# Altium schematic sheet Temperature Sensor.SchDoc
size A4; SheetNumber: 5; SheetTotal: 9
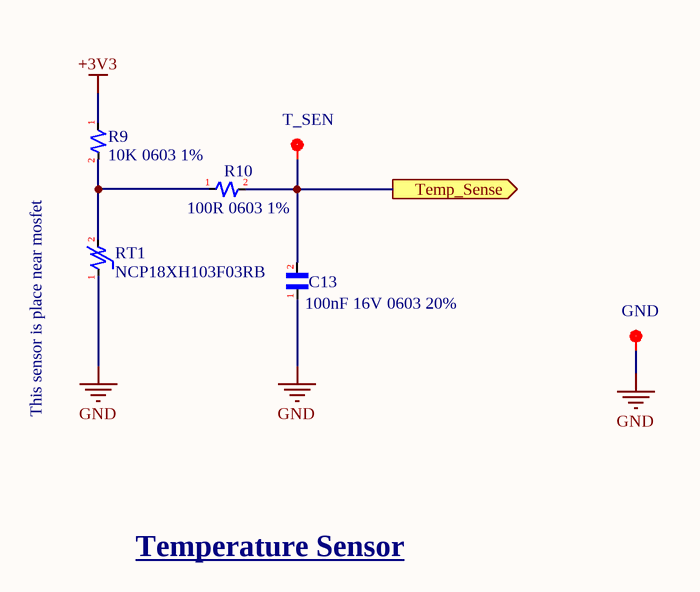
[diagram p0: Temperature Sensor.SchDoc]

## Parts
C13  100nF 16V 0603 20%  [C_0603]
R9  10K 0603 1%  [R_0603]
R10  100R 0603 1%  [R_0603]
RT1  NCP18XH103F03RB  [THRMC1608X95N]
TP19  T_SEN  [TP_1mm_SMD]  (graphical)
TP?  GND  [TP_1mm_SMD]  (graphical)

## Ports
Temp_Sense (out, see TurboSpin[2D], Mcu[2B])

## Nets
+3V3: R9.1
GND: C13.1 RT1.1 TP?.1
Temp_Sense: C13.2 R10.2 TP19.1 ; port Temp_Sense
NetR9_2: R9.2 R10.1 RT1.2

## Notes on the sheet
- This sensor is place near mosfet
- Temperature Sensor

## Library data of the parts
C13 = Capacitor>> Non-Polar: CAP  0603 20%
R9 R10 = Resistor>> General Purpose: RES 0603 20%
RT1 = NCP18XH103F03RB: NTC Thermistor 10k 0603 (1608 Metric); Package: None; Price: None; Value: *; MP: NCP18XH103F03RB; Availability: Unavailable
TP19 TP? = Test point TP